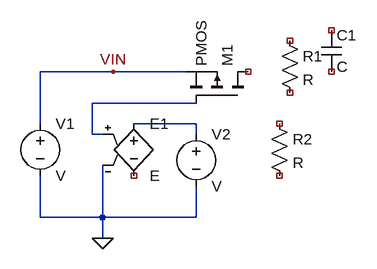
[diagram p0: schematic Draft3.asc]
Draft3.asc, the LTspice schematic file:
Version 4.1
SHEET 1 880 680
WIRE 112 160 0 160
WIRE 224 160 112 160
WIRE 240 208 80 208
WIRE 0 240 0 160
WIRE 240 240 144 240
WIRE 80 256 80 208
WIRE 96 256 80 256
WIRE 240 256 240 240
WIRE 0 384 0 320
WIRE 96 384 96 304
WIRE 96 384 0 384
WIRE 240 384 240 336
WIRE 240 384 96 384
WIRE 96 416 96 384
FLAG 96 416 0
FLAG 112 160 VIN
SYMBOL pmos 320 208 M270
SYMATTR InstName M1
SYMBOL res 368 96 R0
SYMATTR InstName R1
SYMBOL cap 432 96 R0
SYMATTR InstName C1
SYMBOL voltage 0 224 R0
SYMATTR InstName V1
SYMBOL e 144 224 R0
SYMATTR InstName E1
SYMBOL res 352 224 R0
SYMATTR InstName R2
SYMBOL voltage 240 240 R0
SYMATTR InstName V2

The netlist it stands for:
* Draft3.asc
M1 NC_01 N001 VIN VIN PMOS
R1 NC_02 NC_03 R
C1 NC_04 NC_05 C
V1 VIN 0 V
E1 N002 NC_06 N001 0 E
R2 NC_07 NC_08 R
V2 N002 0 V
.model NMOS NMOS
.model PMOS PMOS
.lib standard.mos
.backanno
.end